# Altium schematic sheet USB Interface.SchDoc
size Tabloid
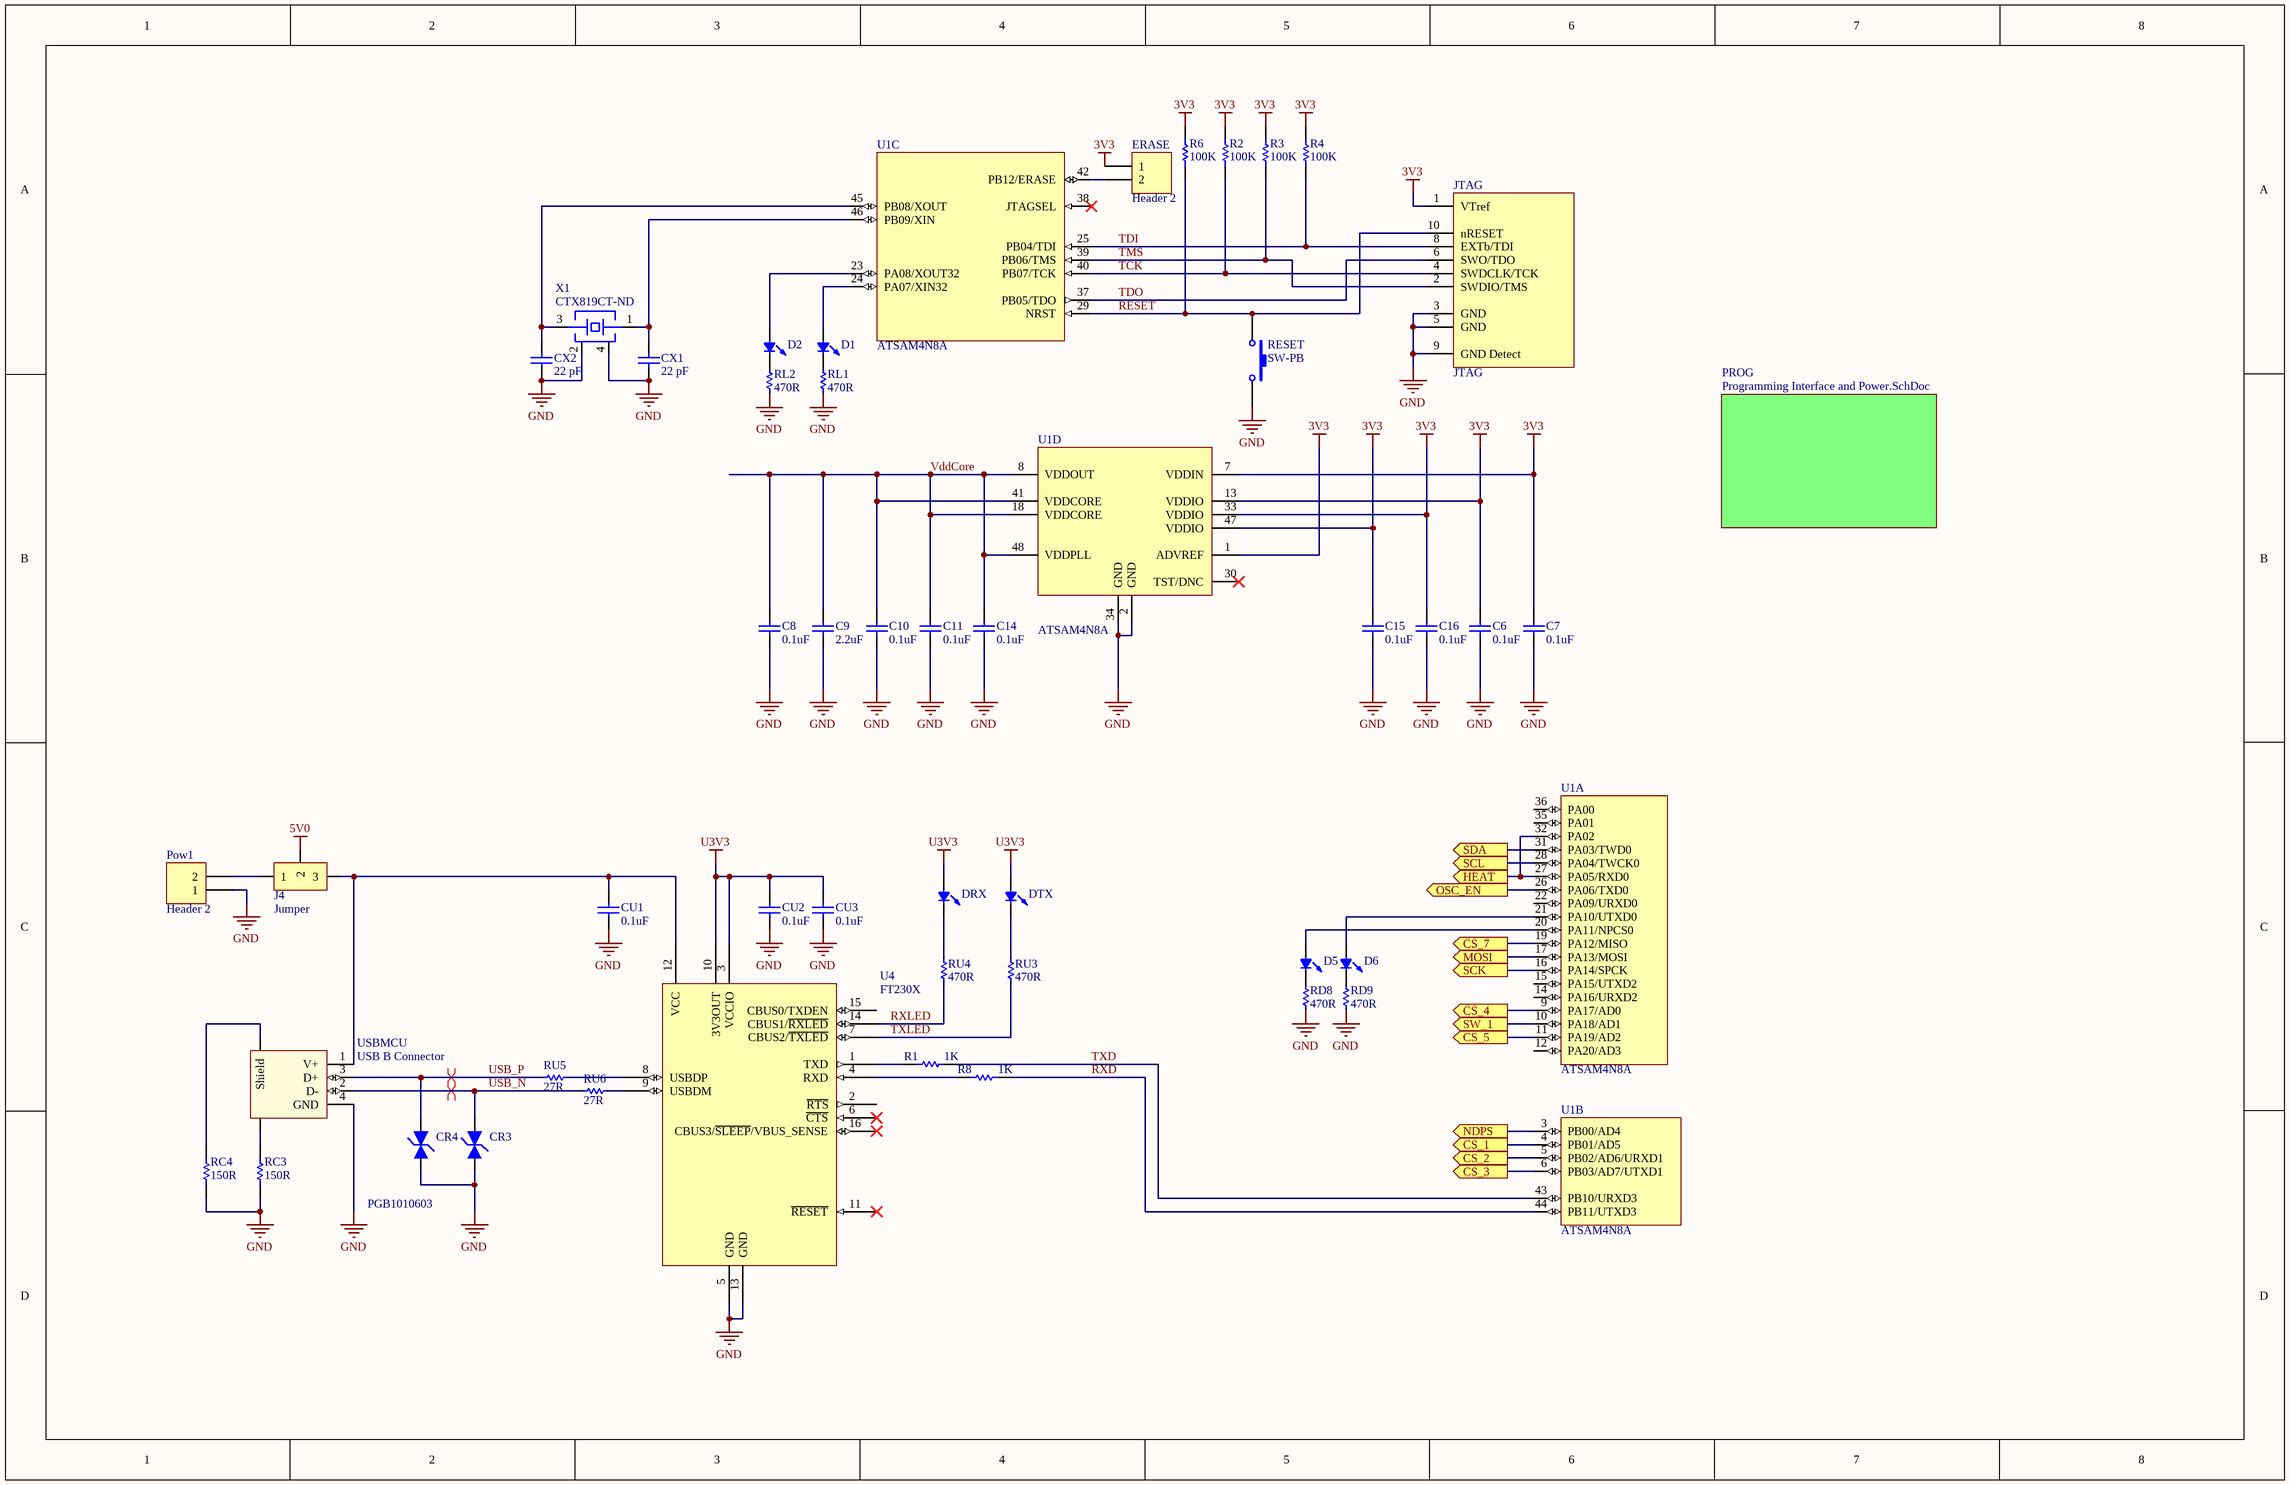
[diagram p0: USB Interface.SchDoc]

## Parts
C6  value 0.1uF  [0603C]  (hidden comment: Cap Semi)
C7  value 0.1uF  [0603C]  (hidden comment: Cap Semi)
C8  value 0.1uF  [0603C]  (hidden comment: Cap Semi)
C9  value 2.2uF  [1206C]  (hidden comment: Cap Semi)
C10  value 0.1uF  [0603C]  (hidden comment: Cap Semi)
C11  value 0.1uF  [0603C]  (hidden comment: Cap Semi)
C14  value 0.1uF  [0603C]  (hidden comment: Cap Semi)
C15  value 0.1uF  [0603C]  (hidden comment: Cap Semi)
C16  value 0.1uF  [0603C]  (hidden comment: Cap Semi)
CR3  PGB1010603  [0603PG]  (value not drawn)
CR4  PGB1010603  [0603PG]
CU1  value 0.1uF  [0603C]  (hidden comment: Cap Semi)
CU2  value 0.1uF  [0603C]  (hidden comment: Cap Semi)
CU3  value 0.1uF  [0603C]  (hidden comment: Cap Semi)
CX1  value 22 pF  [0603C]  (hidden comment: Cap Semi)
CX2  value 22 pF  [0603C]  (hidden comment: Cap Semi)
D1  LED0  [T1 LED]  (value not drawn)
D2  LED0  [T1 LED]  (value not drawn)
D5  LED0  [T1 LED]  (value not drawn)
D6  LED0  [T1 LED]  (value not drawn)
DRX  LED0  [T1 LED]  (value not drawn)
DTX  LED0  [T1 LED]  (value not drawn)
ERASE  Header 2  [HDR1X2]
J4  Jumper  [HDR1X3]
JTAG  JTAG  [MHDR2X5]
Pow1  Header 2  [AMPModu MTE 2 Pin Right Angle PCB-Locking Shrouded Header]
R1  value 1K  [0603R]  (hidden comment: Res Semi)
R2  value 100K  [0603R]  (hidden comment: Res Semi)
R3  value 100K  [0603R]  (hidden comment: Res Semi)
R4  value 100K  [0603R]  (hidden comment: Res Semi)
R6  value 100K  [0603R]  (hidden comment: Res Semi)
R8  value 1K  [0603R]  (hidden comment: Res Semi)
RC3  value 150R  [1206R]  (hidden comment: Res Semi)
RC4  value 150R  [1206R]  (hidden comment: Res Semi)
RD8  value 470R  [0603R]  (hidden comment: Res Semi Small)
RD9  value 470R  [0603R]  (hidden comment: Res Semi Small)
RESET  SW-PB  [TL3302BF180QG/TR]
RL1  value 470R  [0603R]  (hidden comment: Res Semi Small)
RL2  value 470R  [0603R]  (hidden comment: Res Semi Small)
RU3  value 470R  [0603R]  (hidden comment: Res Semi Small)
RU4  value 470R  [0603R]  (hidden comment: Res Semi Small)
RU5  value 27R  [0603R]  (hidden comment: Res Semi Small)
RU6  value 27R  [0603R]  (hidden comment: Res Semi Small)
U1  ATSAM4N8A  [TSQFP50P900X900-48N]  (parts A,B,C,D of 4)
U4  FT230X  [SOP635P600-16AN]
USBMCU  USB B Connector  [USB Connector (type B)]
X1  CTX819CT-ND  [Abracon ABM3B Crystal]

## Sub-sheets
PROG = Programming Interface and Power.SchDoc: no entries

## Ports
CS_1 (out), CS_2 (out), CS_3 (out), CS_4 (out), CS_5 (out), CS_7 (out), HEAT (out), MOSI (out), NDPS (out), OSC_EN (out), SCK (out), SCL (out), SDA (out), SW_1 (out)

## Nets
3V3: C6.2 C7.2 C15.2 C16.2 ERASE.1 JTAG.1(VTref) R2.2 R3.2 R4.2 R6.2 U1.1(ADVREF) U1.7(VDDIN) U1.13(VDDIO) U1.33(VDDIO) U1.47(VDDIO)
5V0: J4.2
GND: C6.1 C7.1 C8.1 C9.1 C10.1 C11.1 C14.1 C15.1 C16.1 CR3.2 CR4.2 CU1.1 CU2.1 CU3.1 CX1.1 CX2.1 JTAG.3(GND) JTAG.5(GND) JTAG.9(GND_Detect) Pow1.1 RC3.1 RC4.1 RD8.2 RD9.2 RESET.2 RL1.2 RL2.2 U1.2(GND) U1.34(GND) U4.5(GND) U4.13(GND) USBMCU.4(GND) X1.2 X1.4
U3V3: CU2.2 CU3.2 DRX.1 DTX.1 U4.3(VCCIO) U4.10(3V3OUT)
CS_1: U1.4(PB01/AD5) ; port CS_1
CS_2: U1.5(PB02/AD6/URXD1) ; port CS_2
CS_3: U1.6(PB03/AD7/UTXD1) ; port CS_3
CS_4: U1.9(PA17/AD0) ; port CS_4
CS_5: U1.11(PA19/AD2) ; port CS_5
CS_7: U1.19(PA12/MISO) ; port CS_7
HEAT: U1.27(PA05/RXD0) U1.32(PA02) ; port HEAT
MOSI: U1.17(PA13/MOSI) ; port MOSI
NDPS: U1.3(PB00/AD4) ; port NDPS
OSC_EN: U1.26(PA06/TXD0) ; port OSC_EN
RESET: JTAG.10(nRESET) R6.1 RESET.1 U1.29(NRST)
RXD: R8.2 U1.44(PB11/UTXD3)
RXLED: RU4.2 U4.14(CBUS1/~{RXLED})
SCK: U1.16(PA14/SPCK) ; port SCK
SCL: U1.28(PA04/TWCK0) ; port SCL
SDA: U1.31(PA03/TWD0) ; port SDA
SW_1: U1.10(PA18/AD1) ; port SW_1
TCK: JTAG.4(SWDCLK/TCK) R2.1 U1.40(PB07/TCK)
TDI: JTAG.8(EXTb/TDI) R4.1 U1.25(PB04/TDI)
TDO: JTAG.6(SWO/TDO) U1.37(PB05/TDO)
TMS: JTAG.2(SWDIO/TMS) R3.1 U1.39(PB06/TMS)
TXD: R1.2 U1.43(PB10/URXD3)
TXLED: RU3.2 U4.7(CBUS2/~{TXLED})
USB_N: CR3.1 RU6.1 USBMCU.2(D-)
USB_P: CR4.1 RU5.1 USBMCU.3(D+)
VddCore: C8.2 C9.2 C10.2 C11.2 C14.2 U1.8(VDDOUT) U1.18(VDDCORE) U1.41(VDDCORE) U1.48(VDDPLL)
NetCU1_2: CU1.2 J4.3 U4.12(VCC) USBMCU.1(V+)
NetCX1_2: CX1.2 U1.46(PB09/XIN) X1.1
NetCX2_2: CX2.2 U1.45(PB08/XOUT) X1.3
NetD1_1: D1.1 U1.24(PA07/XIN32)
NetD1_2: D1.2 RL1.1
NetD2_1: D2.1 U1.23(PA08/XOUT32)
NetD2_2: D2.2 RL2.1
NetD5_1: D5.1 U1.20(PA11/NPCS0)
NetD5_2: D5.2 RD8.1
NetD6_1: D6.1 U1.21(PA10/UTXD0)
NetD6_2: D6.2 RD9.1
NetDRX_2: DRX.2 RU4.1
NetDTX_2: DTX.2 RU3.1
NetERASE_2: ERASE.2 U1.42(PB12/ERASE)
NetJ4_1: J4.1 Pow1.2
NetR1_1: R1.1 U4.1(TXD)
NetR8_1: R8.1 U4.4(RXD)
NetRC3_2: RC3.2 USBMCU.5(Gnd)
NetRC4_2: RC4.2 USBMCU.6(Shield)
NetRU5_2: RU5.2 U4.8(NC)
NetRU6_2: RU6.2 U4.9(USBDM)

Not connected (* = marked no-connect by the designer): U1 12(PA20/AD3) 14(PA16/URXD2) 15(PA15/UTXD2) 22(PA09/URXD0) 30(TST/DNC)* 35(PA01) 36(PA00) 38(JTAGSEL)*; U4 2(~{RTS}) 6(~{CTS})* 11(~{RESET})* 15(CBUS0/TXDEN) 16(CBUS3/~{SLEEP}/VBUS_SENSE)* 24(NC)

## Layout directives
differential pair: USB_N, USB_P

## Library data of the parts
C6-C11 C14-C16 CU1-CU3 CX1 CX2 = Cap Semi: Capacitor (Semiconductor SIM Model); Published: 8-Jun-2000; LatestRevisionDate: 17-Jul-2002; LatestRevisionNote: Re-released for DXP Platform.; PackageReference: C1206; Publisher: Altium Limited
CR3 CR4 = PGB1010603: PulseGuard® Lead-Free 0603 Surface Mount Polymeric ESD Suppressors
D1 D2 D5 D6 DRX DTX = LED0: T 1 3/4 LED; Published: 8-Jun-2000; LatestRevisionDate: 08-Jul-2005; LatestRevisionNote: Mech Layer 1 removed.; PackageReference: LED-0; Publisher: Altium Limited
ERASE Pow1 = Header 2: Header, 2-Pin; LatestRevisionDate: 17-Jul-2002; LatestRevisionNote: Re-released for DXP Platform.; Publisher: Altium Limited
J4 = Jumper - 3 Pin: Jumper - 3-Pin; LatestRevisionDate: 17-Jul-2002; LatestRevisionNote: Re-released for DXP Platform.; Publisher: Altium Limited
JTAG = ARM JTAG-10: ARM 10-Pin JTAG Interface
R1-R4 R6 R8 RC3 RC4 = Res Semi: Semiconductor Resistor; Published: 8-Jun-2000; LatestRevisionDate: 17-Jul-2002; LatestRevisionNote: Re-released for DXP Platform.; PackageReference: AXIAL-0.5; Publisher: Altium Limited
RD8 RD9 RL1 RL2 RU3-RU6 = Res Semi Small: Semiconductor Resistor; Published: 8-Jun-2000; LatestRevisionDate: 17-Jul-2002; LatestRevisionNote: Re-released for DXP Platform.; PackageReference: AXIAL-0.5; Publisher: Altium Limited
RESET = SW-PB: Switch; Published: 24-Mar-1999; LatestRevisionDate: 17-Jul-2002; LatestRevisionNote: Re-released for DXP Platform.; PackageReference: SPST-2; Publisher: Altium Limited
U1 = ATSAM4N8A: SAM4N ARM Cortex-M4 Microcontrollers
U4 = FT230X: USB To Basic Serial Bridge IC; DKPN: 768-1135-1-ND; Datasheet: http://www.ftdichip.com/Support/Documents/DataSheets/ICs/DS_FT230X.pdf
USBMCU = USB B connector - Through hole
X1 = SMT Crystal: 16 MHz Micro SMT Crystal; DKPN: 535-9122-1-ND; MFGPN: ABM3B-16.000MHZ-B2-T; DKDESC: CRYSTAL 16.000MHZ 18PF SMD